# Altium schematic sheet Quectel_BC260Y-CN_SCH_Part_AD_V1.0.SchDoc
size A3
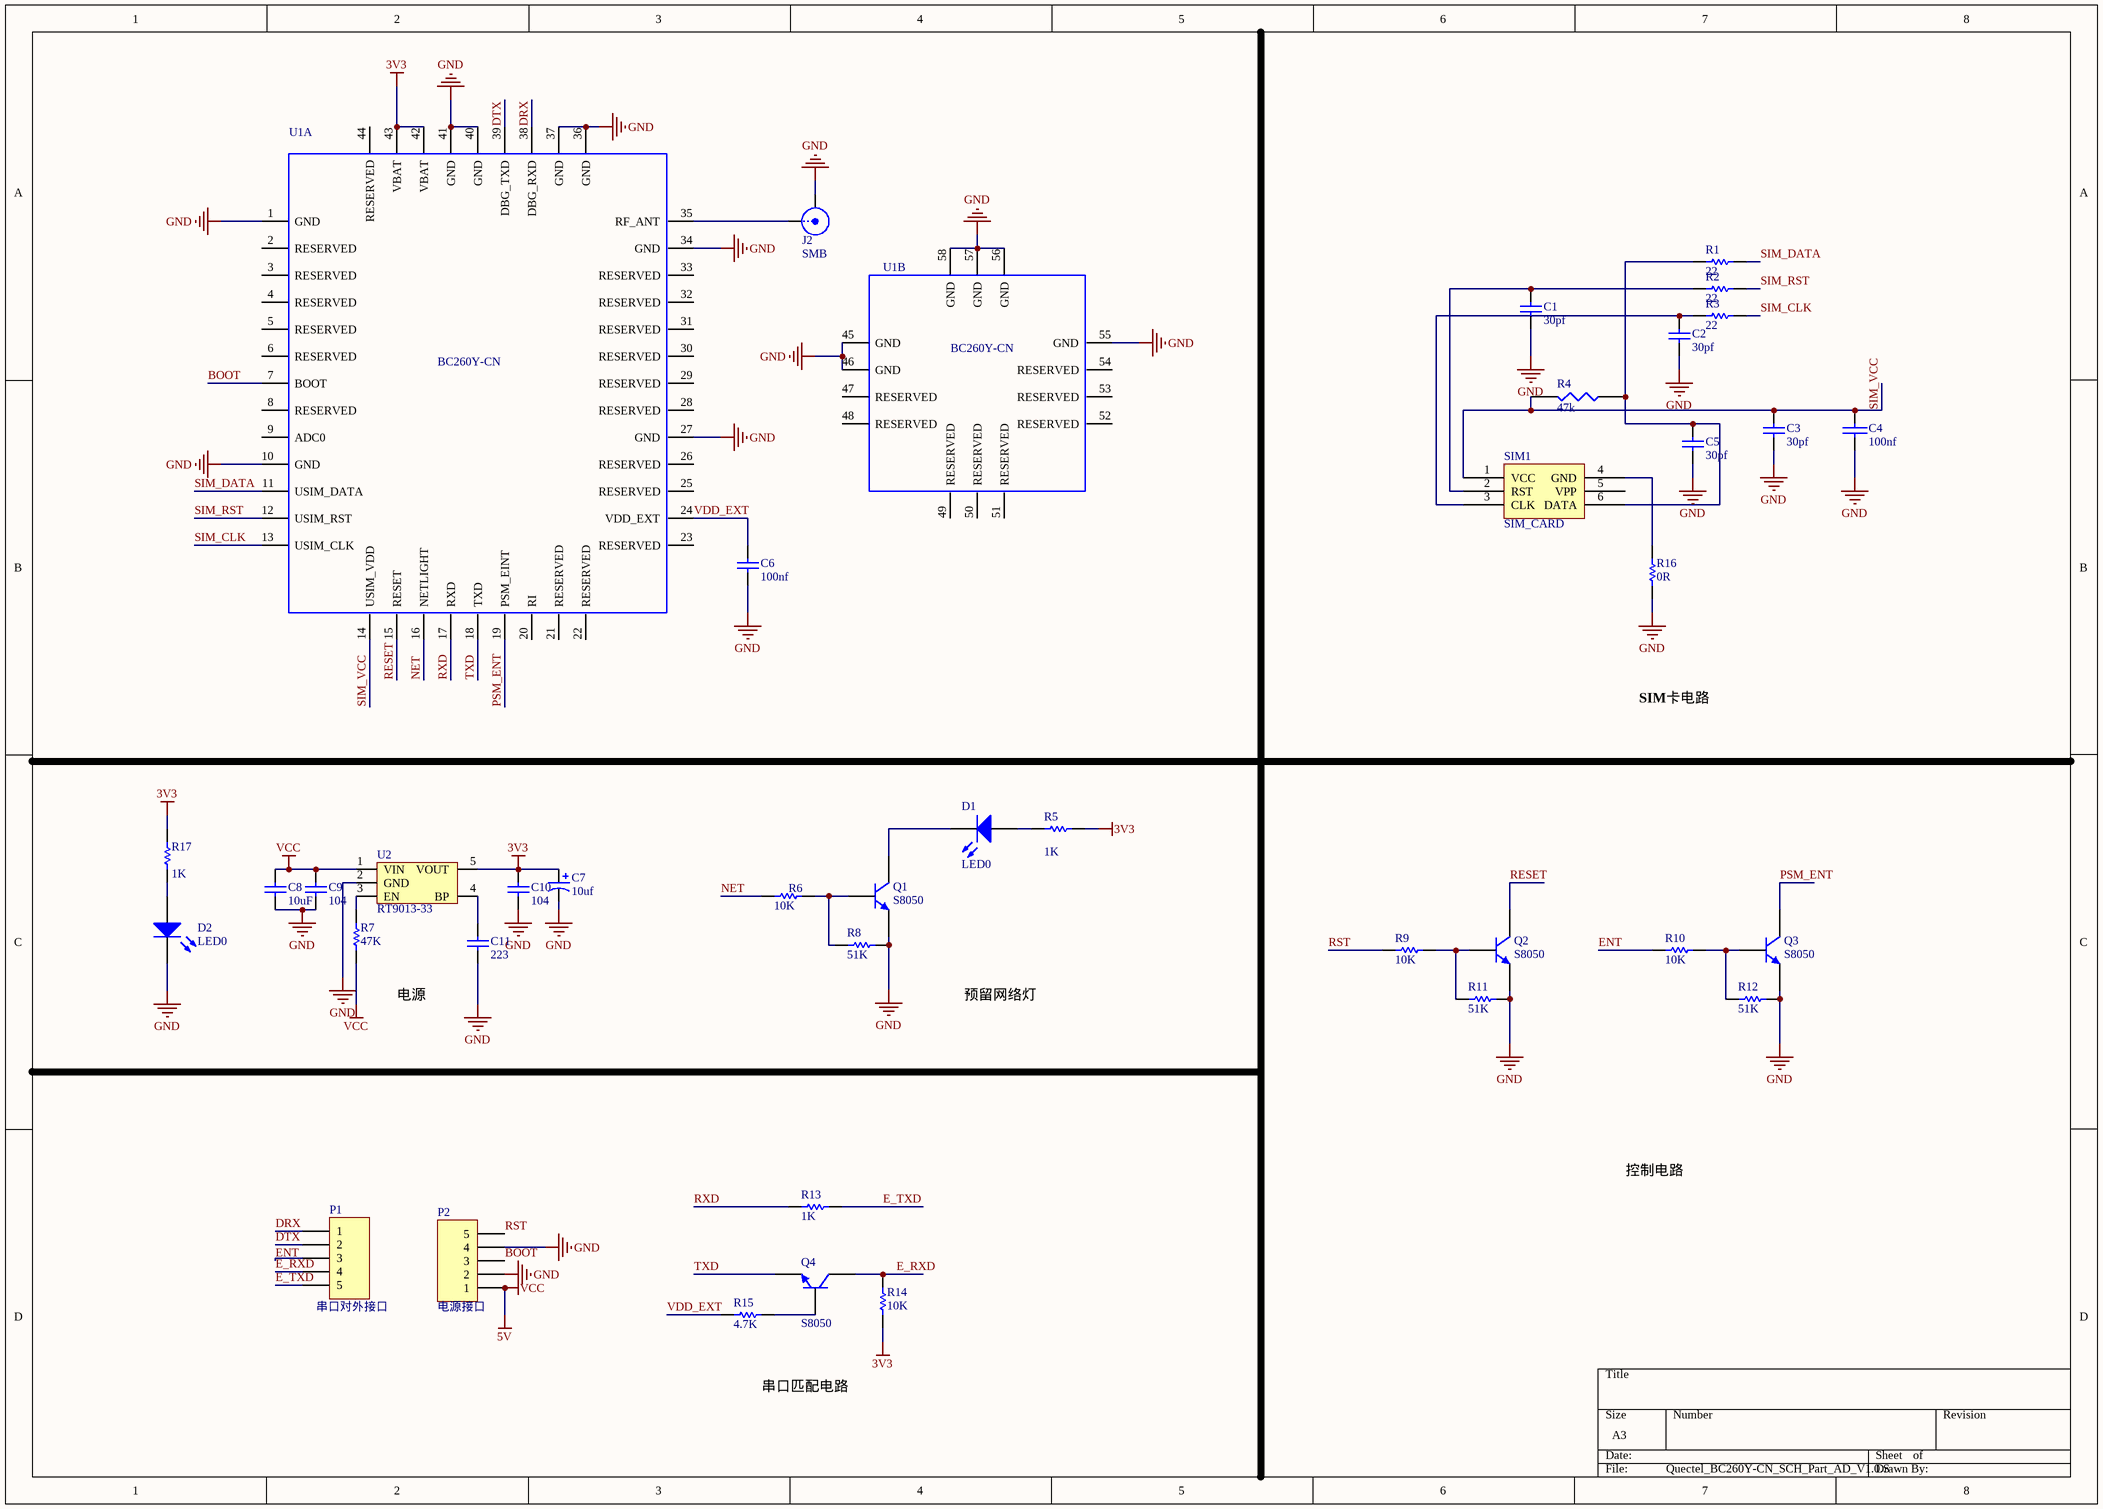
[diagram p0: Quectel_BC260Y-CN_SCH_Part_AD_V1.0.SchDoc]

## Parts
C1  30pf  [0603A]
C2  30pf  [0603A]
C3  30pf  [0603A]
C4  100nf  [0603A]
C5  30pf  [0603A]
C6  100nf  [0603a]
C7  10uf  [1206]
C8  10uF  [1206]
C9  104  [0603a]
C10  104  [0603a]
C11  223  [0603a]
D1  LED0  [0603led]
D2  LED0  [0603led]
J2  SMB  [ipex]
P1  串口对外接口  [HDR1X5]
P2  电源接口  [HDR1X5]
Q1  S8050  [s8550]
Q2  S8050  [s8550]
Q3  S8050  [s8550]
Q4  S8050  [S8550]
R1  22  [0603A]
R2  22  [0603A]
R3  22  [0603A]
R4  47k  [0603A]
R5  value 1K  [0603a]
R6  10K  [0603A]
R7  47K  [0603a]
R8  51K  [0603A]
R9  10K  [0603A]
R10  10K  [0603A]
R11  51K  [0603A]
R12  51K  [0603A]
R13  1K  [0603A]
R14  10K  [0603A]
R15  4.7K  [0603A]
R16  0R  [0603A]
R17  value 1K  [0603a]
SIM1  SIM_CARD  [microSIMauto]
U1  BC260Y-CN  [bc260y]  (parts A,B of 2)
U2  RT9013-33  [SOT-23-5]

## Nets
3V3: C7.1(+) C10.1 R5.1 R14.1 R17.1 U1.42(VBAT) U1.43(VBAT) U2.5(VOUT)
5V: C8.2 C9.2 P2.1 R7.1 U2.1(VIN)  [also labelled VCC]
GND: C1.1 C2.1 C3.1 C4.2 C5.1 C6.1 C7.2(-) C8.1 C9.1 C10.2 C11.2 D2.2(K) J2.2(Y) P2.2 P2.4 Q1.1(E) Q2.1(E) Q3.1(E) R8.2 R11.2 R12.2 R16.1 U1.1(GND) U1.10(GND) U1.27(GND) U1.34(GND) U1.36(GND) U1.37(GND) U1.40(GND) U1.41(GND) U1.45(GND) U1.46(GND) U1.55(GND) U1.56(GND) U1.57(GND) U1.58(GND) U2.2(GND)
BOOT: P2.3 U1.7(BOOT)
DRX: P1.1 U1.38(DBG_RXD)
DTX: P1.2 U1.39(DBG_TXD)
E_RXD: P1.4 Q4.3(C) R14.2
E_TXD: P1.5 R13.2
ENT: P1.3 R10.1
NET: R6.1 U1.16(NETLIGHT)
PSM_ENT: Q3.3(C) U1.19(PSM_EINT)
RESET: Q2.3(C) U1.15(RESET)
RST: P2.5 R9.1
RXD: R13.1 U1.17(RXD)
SIM_CLK: R3.1 U1.13(USIM_CLK)
SIM_DATA: R1.1 U1.11(USIM_DATA)
SIM_RST: R2.1 U1.12(USIM_RST)
SIM_VCC: C3.2 C4.1 R4.2 SIM1.1(VCC) U1.14(USIM_VDD)
TXD: Q4.1(E) U1.18(TXD)
VDD_EXT: C6.2 R15.1 U1.24(VDD_EXT)
NetC1_2: C1.2 R2.2 SIM1.2(RST)
NetC2_2: C2.2 R3.2 SIM1.3(CLK)
NetC5_2: C5.2 R1.2 R4.1 SIM1.6(DATA)
NetC11_1: C11.1 U2.4(BP)
NetD1_1: D1.1(A) R5.2
NetD1_2: D1.2(K) Q1.3(C)
NetD2_1: D2.1(A) R17.2
NetJ2_1: J2.1(X) U1.35(RF_ANT)
NetQ1_2: Q1.2(B) R6.2 R8.1
NetQ2_2: Q2.2(B) R9.2 R11.1
NetQ3_2: Q3.2(B) R10.2 R12.1
NetQ4_2: Q4.2(B) R15.2
NetR7_2: R7.2 U2.3(EN)
NetR16_2: R16.2 SIM1.4(GND)

Not connected (* = marked no-connect by the designer): SIM1 5(VPP); U1 2(RESERVED) 3(RESERVED) 4(RESERVED) 5(RESERVED) 6(RESERVED) 8(RESERVED) 9(ADC0) 20(RI) 21(RESERVED) 22(RESERVED) 23(RESERVED) 25(RESERVED) 26(RESERVED) 28(RESERVED) 29(RESERVED) 30(RESERVED) 31(RESERVED) 32(RESERVED) 33(RESERVED) 44(RESERVED) 47(RESERVED) 48(RESERVED) 49(RESERVED) 50(RESERVED) 51(RESERVED) 52(RESERVED) 53(RESERVED) 54(RESERVED)

## Notes on the sheet
- SIM卡电路
- 电源
- 预留网络灯
- 控制电路
- 串口匹配电路

## Library data of the parts
C1-C3 C5 = Cap: Capacitor; Published: 8-Jun-2000; LatestRevisionDate: 17-Jul-2002; LatestRevisionNote: Re-released for DXP Platform.; PackageReference: RAD-0.3; Publisher: Altium Limited; PackageDescription: Radial Cap, Thru-Hole; 2 Leads; 0.3 in Pin Spacing; Value: 30pf
C4 = CAP: Capacitor
C6 C8-C11 = Cap: Capacitor; Value: 100pF; Published: 8-Jun-2000; LatestRevisionDate: 17-Jul-2002; LatestRevisionNote: Re-released for DXP Platform.; PackageReference: RAD-0.3; Publisher: Altium Limited; PackageDescription: Radial Cap, Thru-Hole; 2 Leads; 0.3 in Pin Spacing
C7 = CAP-POL
D1 D2 = LED0: Typical INFRARED GaAs LED; Published: 8-Jun-2000; LatestRevisionDate: 08-Jul-2005; LatestRevisionNote: Mech Layer 1 removed.; PackageReference: LED-0; Publisher: Altium Limited; PackageDescription: LED; 2 Leads
J2 = SMB: SMB Straight Connector; LatestRevisionDate: 17-Jul-2002; LatestRevisionNote: Re-released for DXP Platform.; Publisher: Altium Limited
P1 P2 = Header 5: Header, 5-Pin; LatestRevisionDate: 17-Jul-2002; LatestRevisionNote: Re-released for DXP Platform.; Publisher: Altium Limited
Q1-Q4 = 2N3904: NPN General Purpose Amplifier; Published: 8-Jun-2000; LatestRevisionDate: 15-Jan-2003; LatestRevisionNote: PCB Footprint 'BCY-W3/D4.7' replaced; DatasheetVersion: 1997; PackageVersion: Sep-1998; PackageReference: TO-92A; Publisher: Altium Limited; PackageDescription: TO, Flat Index; 3 In-Line, Axial Leads; Body Dia. 4.5mm; Leads 0.51 x 0.48 mm (max); ComponentLink1Description: Manufacturer Link; ComponentLink1URL: http://www.fairchildsemi.com/; ComponentLink2Description: Datasheet; ComponentLink2URL: http://www.fairchildsemi.com/ds/2N%2F2N3904.pdf
R1-R3 R7 R13 = Res1: Resistor; Published: 8-Jun-2000; LatestRevisionDate: 17-Jul-2002; LatestRevisionNote: Re-released for DXP Platform.; PackageReference: AXIAL-0.3; Publisher: Altium Limited; PackageDescription: Axial Device, Thru-Hole; 2 Leads; 0.3 in Pin Spacing
  R1-R3: Value: 22
  R7: Value: 47K
  R13: Value: 1K
R4 = RES1
R5 R17 = Res Semi: Semiconductor Resistor; Published: 8-Jun-2000; LatestRevisionDate: 17-Jul-2002; LatestRevisionNote: Re-released for DXP Platform.; PackageReference: AXIAL-0.5; Publisher: Altium Limited; PackageDescription: Axial Device, Thru-Hole; 2 Leads; 0.5 in Pin Spacing
R6 R8-R12 R14-R16 = Res1: Resistor; Value: 1K; Published: 8-Jun-2000; LatestRevisionDate: 17-Jul-2002; LatestRevisionNote: Re-released for DXP Platform.; PackageReference: AXIAL-0.3; Publisher: Altium Limited; PackageDescription: Axial Device, Thru-Hole; 2 Leads; 0.3 in Pin Spacing
U1 = BC260Y-CN: Part Description: BC260Y-CN 17.7×15.8mm H2.2mm RO; Manufacturer: QUECTEL; Geometry.Height: 2.2mm; Value: BC260Y-CN; BOMRemark: *; option: *; Part Number: *; PCB DECAL: BC260Y-CN
U2 = RT9193-33: 3.3V超低压差LDO